# Altium schematic sheet MCU.SchDoc
size Letter; SheetNumber: 2; SheetTotal: 3
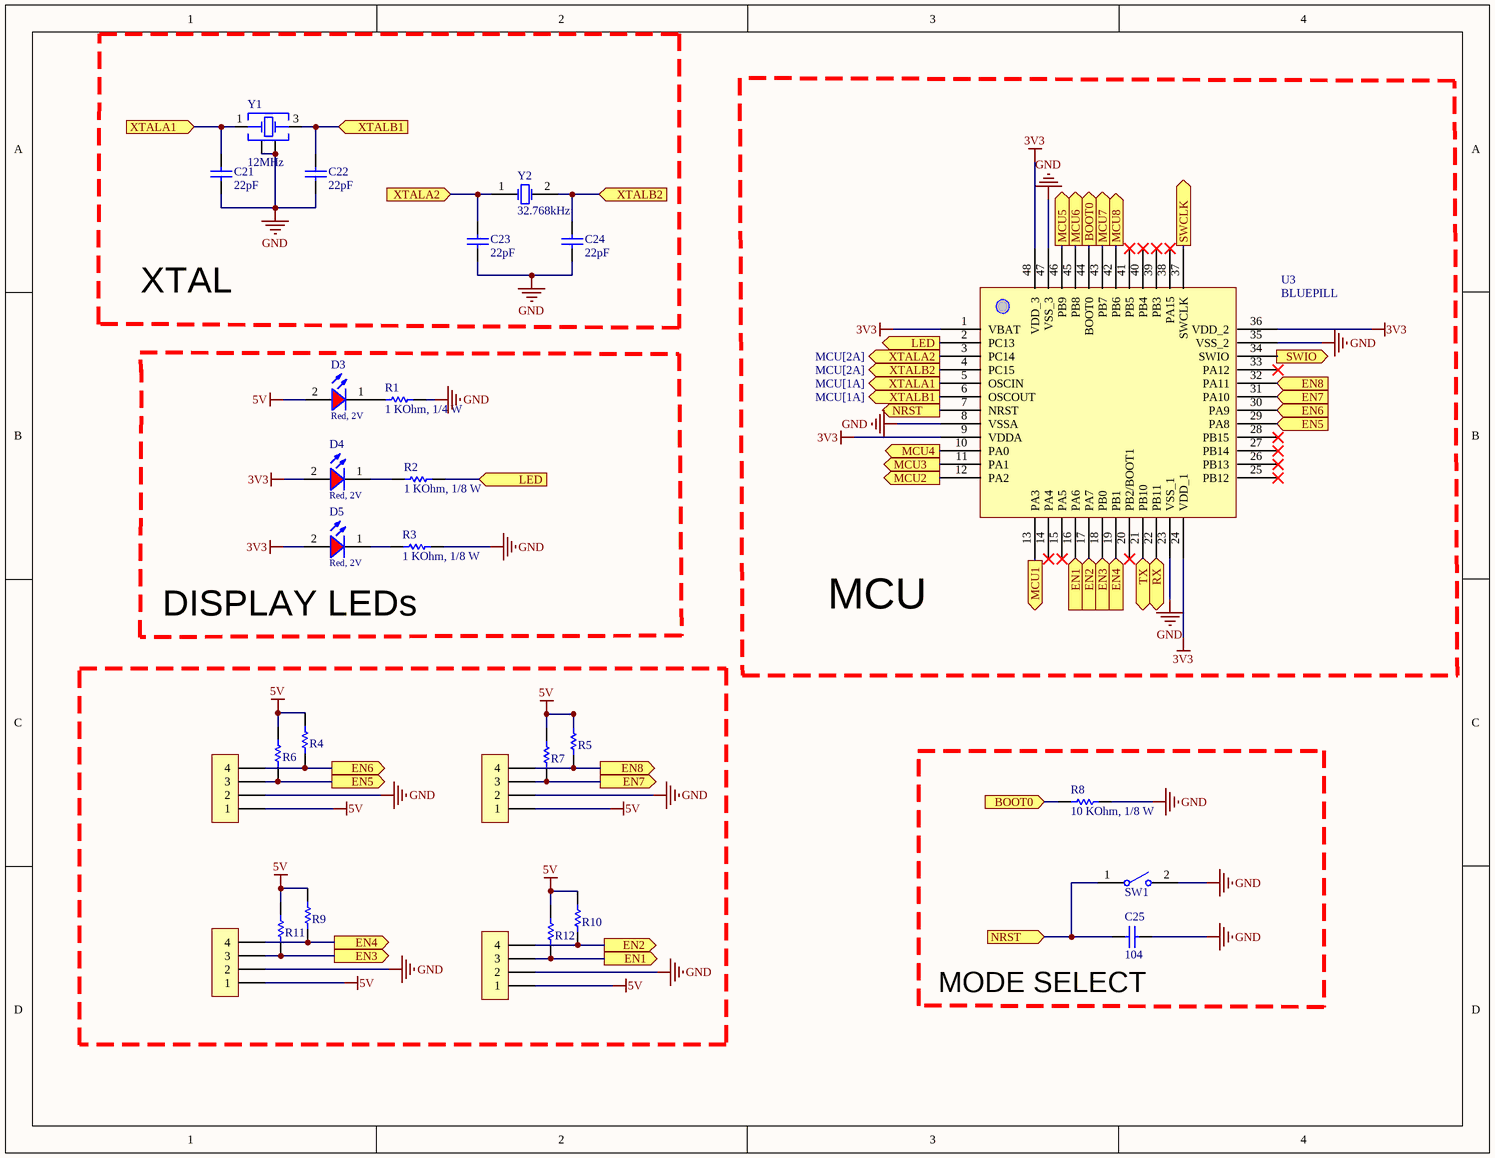
[diagram p0: MCU.SchDoc]

## Parts
C21  22pF  [tu 0603]
C22  22pF  [tu 0603]
C23  22pF  [tu 0603]
C24  22pF  [tu 0603]
C25  104  [tu 0805]
D3  Red, 2V  [WL-SMCW_0603_H=0.7mm]
D4  Red, 2V  [WL-SMCW_0603_H=0.7mm]
D5  Red, 2V  [WL-SMCW_0603_H=0.7mm]
H1  Header 4P 2.54 Duc Cong  [Header 4P DC 2.54]  (value not drawn)
H2  Header 4P 2.54 Duc Cong  [Header 4P DC 2.54]  (value not drawn)
H3  Header 4P 2.54 Duc Cong  [Header 4P DC 2.54]  (value not drawn)
H4  Header 4P 2.54 Duc Cong  [Header 4P DC 2.54]  (value not drawn)
R1  1 KOhm, 1/4 W  [resistor_0603]
R2  1 KOhm, 1/8 W  [RESISTOR_0805]
R3  1 KOhm, 1/8 W  [RESISTOR_0805]
R4  1 KOhm, 1/8 W  [RESISTOR_0805]  (value not drawn)
R5  1 KOhm, 1/8 W  [RESISTOR_0805]  (value not drawn)
R6  1 KOhm, 1/8 W  [RESISTOR_0805]  (value not drawn)
R7  1 KOhm, 1/8 W  [RESISTOR_0805]  (value not drawn)
R8  10 KOhm, 1/8 W  [RESISTOR_0805]
R9  1 KOhm, 1/8 W  [RESISTOR_0805]  (value not drawn)
R10  1 KOhm, 1/8 W  [RESISTOR_0805]  (value not drawn)
R11  1 KOhm, 1/8 W  [RESISTOR_0805]  (value not drawn)
R12  1 KOhm, 1/8 W  [RESISTOR_0805]  (value not drawn)
SW1  434111050826  [WS-TASV_L6W3.5H5_4341x10508x6]  (value not drawn)
U3  BLUEPILL  [STM32F103C8T6]
Y1  12MHz  [WE-XTAL_CFPX-180]
Y2  32.768kHz  [WE-XTAL_WATCH_830014219B]

## Blocks framed on the sheet
XTAL: C21-C24 Y1 Y2
MCU: U3
MODE SELECT: C25 R8 SW1

## Ports
BOOT0 (in, see MCU[3A]), BOOT0 (out, see MCU[3C]), EN1 (in, see MCU[2D]), EN1 (out, see MCU[3C]), EN2 (in, see MCU[2D]), EN2 (out, see MCU[3C]), EN3 (in, see MCU[1D]), EN3 (out, see MCU[3C]), EN4 (in, see MCU[1D]), EN4 (out, see MCU[3C]), EN5 (in, see MCU[1C]), EN5 (out, see MCU[4B]), EN6 (in, see MCU[1C]), EN6 (out, see MCU[4B]), EN7 (in, see MCU[2C]), EN7 (out, see MCU[4B]), EN8 (in, see MCU[2C]), EN8 (out, see MCU[4B]), LED (in, see MCU[3B]), LED (out, see MCU[2B]), MCU1 (out, see BTS7960[2C]), MCU2 (out, see BTS7960[2C]), MCU3 (out, see BTS7960[2C]), MCU4 (out, see BTS7960[2C]), MCU5 (out, see BTS7960[2C]), MCU6 (out, see BTS7960[2C]), MCU7 (out, see BTS7960[2C]), MCU8 (out, see BTS7960[2C]), NRST (in, see MCU[3B]), NRST (out, see MCU[3D]), RX (bidir, see BTS7960[2B]), SWCLK (out, see BTS7960[2B]), SWIO (out, see BTS7960[2A]), TX (bidir, see BTS7960[2B]), XTALA1 (in, see MCU[3B]), XTALA1 (out, see MCU[1A]), XTALA2 (in, see MCU[3B]), XTALA2 (out, see MCU[2A]), XTALB1 (in, see MCU[3B]), XTALB1 (out, see MCU[1A]), XTALB2 (in, see MCU[3B]), XTALB2 (out, see MCU[2A])

## Nets
3V3: D4.2(A) D5.2(A) U3.1(VBAT) U3.9(VDDA) U3.24(VDD_1) U3.36(VDD_2) U3.48(VDD_3)
5V: D3.2(A) H1.1 H2.1 H3.1 H4.1 R4.2 R5.2 R6.2 R7.2 R9.2 R10.2 R11.2 R12.2
GND: C21.1 C22.2 C23.2 C24.2 C25.2 H1.2 H2.2 H3.2 H4.2 R1.2 R3.2 R8.2 SW1.2 U3.8(VSSA) U3.23(VSS_1) U3.35(VSS_2) U3.47(VSS_3) Y1.2(GND) Y1.4(GND)
BOOT0: R8.1 U3.44(BOOT0) ; port BOOT0
EN1: H4.3 R12.1 U3.16(PA6) ; port EN1
EN2: H4.4 R10.1 U3.17(PA7) ; port EN2
EN3: H3.3 R11.1 U3.18(PB0) ; port EN3
EN4: H3.4 R9.1 U3.19(PB1) ; port EN4
EN5: H1.3 R6.1 U3.29(PA8) ; port EN5
EN6: H1.4 R4.1 U3.30(PA9) ; port EN6
EN7: H2.3 R7.1 U3.31(PA10) ; port EN7
EN8: H2.4 R5.1 U3.32(PA11) ; port EN8
LED: R2.2 U3.2(PC13) ; port LED
MCU1: U3.13(PA3) ; port MCU1
MCU2: U3.12(PA2) ; port MCU2
MCU3: U3.11(PA1) ; port MCU3
MCU4: U3.10(PA0) ; port MCU4
MCU5: U3.46(PB9) ; port MCU5
MCU6: U3.45(PB8) ; port MCU6
MCU7: U3.43(PB7) ; port MCU7
MCU8: U3.42(PB6) ; port MCU8
NRST: C25.1 SW1.1 U3.7(NRST) ; port NRST
RX: U3.22(PB11) ; port RX
SWCLK: U3.37(SWCLK) ; port SWCLK
SWIO: U3.34(SWIO) ; port SWIO
TX: U3.21(PB10) ; port TX
XTALA1: C21.2 U3.5(OSCIN) Y1.1(Crystal) ; port XTALA1
XTALA2: C23.1 U3.3(PC14) Y2.1(OSC1) ; port XTALA2
XTALB1: C22.1 U3.6(OSCOUT) Y1.3(Crystal) ; port XTALB1
XTALB2: C24.1 U3.4(PC15) Y2.2(OSC2) ; port XTALB2
NetD3_1: D3.1(K) R1.1
NetD4_1: D4.1(K) R2.1
NetD5_1: D5.1(K) R3.1

Not connected (* = marked no-connect by the designer): U3 14(PA4)* 15(PA5)* 20(PB2/BOOT1)* 25(PB12)* 26(PB13)* 27(PB14)* 28(PB15)* 33(PA12)* 38(PA15)* 39(PB3)* 40(PB4)* 41(PB5)*

## Notes on the sheet
- DISPLAY LEDs

## Library data of the parts
C21-C24 = Tu 0603 22pF 50V 10%: Dán; Don_Vi: Con; So_Chan: 2; Ten_Linh_Kien: Tụ 0603 22pF 50V 10%; Ma_Hang: MH004570; Chung_Loai: Dán; Kieu_Chan: *
C25 = Tu 0805 104 50V 10%: Dán; Don_Vi: Con; So_Chan: 2; Ten_Linh_Kien: Tụ 0805 104-100nF 10% 50V; Ma_Hang: MH004551; Chung_Loai: Dán; Kieu_Chan: *
D3 = 160603RedClear: WL-SMCW SMT Mono-color Chip LED Waterclear, size 0603, Red, 2V, 140deg; Type: Clear; Color: Red; Size: 0603; ComponentLink1Description: Datasheet link; ComponentLink1URL: N/A; ComponentLink2Description: Supplier 1 URL; ComponentLink2URL: https://www.mouser.vn/ProductDetail/Wurth-Elektronik/150060RS75000?qs=LlUlMxKIyB3QnmZ3fw%2FVCA%3D%3D; ComponentLink3Description: Supplier 2 URL; ComponentLink3URL: https://www.digikey.com/en/products/detail/liteon/LTST-C191KRKT/386837; ComponentLink4Description: Supplier 3 URL; ComponentLink4URL: https://www.thegioiic.com/led-do-0603-dan-smd-trong-suot; Supplier 1 Name: Mouser; Supplier 1 SN: 710-150060RS75000; Supplier 1 URL: https://www.mouser.vn/ProductDetail/Wurth-Elektronik/150060RS75000?qs=LlUlMxKIyB3QnmZ3fw%2FVCA%3D%3D; Supplier 2 Name: Digi-Key; Supplier 2 SN: 160-1447-2-ND; Supplier 2 URL: https://www.digikey.com/en/products/detail/liteon/LTST-C191KRKT/386837; Supplier 3 Name: ICDayRoi; Supplier 3 SN: N/A; Supplier 3 URL: https://www.thegioiic.com/led-do-0603-dan-smd-trong-suot; Value: Red, 2V
D4 D5 = 160603RedBlur: WL-SMCW SMT Mono-color Chip LED Blur, size 0603, Red, 2V, 140deg; Color: Red; Size: 0603; Type: Blur; ComponentLink1Description: Datasheet link; ComponentLink1URL: N/A; ComponentLink2Description: Supplier 1 URL; ComponentLink2URL: https://www.mouser.vn/ProductDetail/ROHM-Semiconductor/CSL1901VW1?qs=vvQtp7zwQdNmrXZcE27xEA%3D%3D; ComponentLink3Description: Supplier 2 URL; ComponentLink3URL: https://www.digikey.com/en/products/detail/rohm-semiconductor/SML-D12U8WT86/1641799; ComponentLink4Description: Supplier 3 URL; ComponentLink4URL: N/A; Supplier 1 Name: Mouser; Supplier 1 SN: 755-CSL1901VW1; Supplier 1 URL: https://www.mouser.vn/ProductDetail/ROHM-Semiconductor/CSL1901VW1?qs=vvQtp7zwQdNmrXZcE27xEA%3D%3D; Supplier 2 Name: Digi-Key; Supplier 2 SN: 511-1580-2-ND; Supplier 2 URL: https://www.digikey.com/en/products/detail/rohm-semiconductor/SML-D12U8WT86/1641799; Supplier 3 Name: ICDayRoi; Supplier 3 SN: N/A; Supplier 3 URL: N/A; Value: Red, 2V
H1-H4 = Header 4P 2.54 Duc Cong: Cắm; Ten_Linh_Kien: Header 4P XH2.54-4P Đực Cong; Don_Vi: Con; Ma_Hang: MH001310; Chung_Loai: Cắm
R1 = 0006031021: RES, size 0603, 1 KOhm, 1/4 W; Manufacture  Name: OEM; Resistance: 1 KOhm; Rated Power: 1/4 W; Resistance Tolerance: +/-1%; Size: 0603; Mounting Technology: SMT; Supplier 1 Name: Mouser; Supplier 1 SN: 71-RCS06031K00FKEA; Supplier 2 Name: Digi-Key; Supplier 2 SN: YAG5829TR-ND YAG5829CT-ND YAG5829DKR-ND; Supplier 1 URL: https://www.mouser.vn/ProductDetail/Vishay-Dale/RCS06031K00FKEA?qs=sGAEpiMZZMvdGkrng054t9clqp6gtJJdzI9PGMrTQi4RTIuHToNahw%3D%3D; Supplier 3 Name: thegioiic; Supplier 3 SN: N/A; Supplier 3 URL: N/A; Manufacture  SN: OEM; Value: 1 KOhm, 1/4 W; ComponentLink1Description: Datasheet link; ComponentLink1URL: https://www.yageo.com/upload/media/product/productsearch/datasheet/rchip/PYu-SR_20105_RoHS_L_10.pdf; ComponentLink2Description: Supplier 1 URL; ComponentLink2URL: N/A; ComponentLink3Description: Supplier 2 URL; ComponentLink3URL: https://www.digikey.com/en/products/detail/yageo/SR0603FR-7T1KL/9373103; ComponentLink4Description: Supplier 3 URL; ComponentLink4URL: N/A; Supplier 2 URL: https://www.digikey.com/en/products/detail/yageo/SR0603FR-7T1KL/9373103
R2-R7 R9-R12 = 0008051025: RES, size 0805, 1 KOhm, 1/8 W; Manufacture  Name: Vishay Dale; Manufacture  SN: CRCW08051K00JNEAC; Resistance tolerance: +/-5%; Rated Power: 1/8 W; Resistance: 1 KOhm; Size: 0805; Mounting Technology: SMT; Supplier 1 Name: Mouser; Supplier 1 SN: 71-CRCW08051K00JNEC; Supplier 1 URL: https://www.mouser.vn/ProductDetail/Vishay-Dale/CRCW08051K00JNEC?qs=OW6ROCK%252BaiZqKFsNe9zjFw%3D%3D; Supplier 2 Name: Digi-Key; Supplier 2 SN: 541-4162-2-ND; Supplier 2 URL: https://www.digikey.com/en/products/detail/vishay-dale/CRCW08051K00JNEAC/7928584; Supplier 3 Name: Thegioiic; Supplier 3 SN: N/A; Supplier 3 URL: https://www.thegioiic.com/dien-tro-1-kohm-0805-5-; Value: 1 KOhm, 1/8 W; ComponentLink1Description: Datasheet link; ComponentLink1URL: https://www.vishay.com/docs/28773/crcwce3.pdf; ComponentLink2Description: Supplier 1 URL; ComponentLink2URL: https://www.mouser.vn/ProductDetail/Vishay-Dale/CRCW08051K00JNEC?qs=OW6ROCK%252BaiZqKFsNe9zjFw%3D%3D; ComponentLink3Description: Supplier 2 URL; ComponentLink3URL: https://www.digikey.com/en/products/detail/vishay-dale/CRCW08051K00JNEAC/7928584; ComponentLink4Description: Supplier 3 URL; ComponentLink4URL: https://www.thegioiic.com/dien-tro-1-kohm-0805-5-
R8 = 0008051035: RES, size 0805, 10 KOhm, 1/8 W; Manufacture  Name: Vishay Dale; Manufacture  SN: CRCW080510K0JNEAC; Resistance tolerance: +/-5%; Rated Power: 1/8 W; Resistance: 10 KOhm; Size: 0805; Mounting Technology: SMT; Supplier 1 Name: Mouser; Supplier 1 SN: 71-CRCW080510K0JNEB; Supplier 1 URL: https://www.mouser.vn/ProductDetail/Vishay-Dale/CRCW080510K0JNEB?qs=LOX6nxTstiZ5fn9YUdHx5A%3D%3D; Supplier 2 Name: Digi-Key; Supplier 2 SN: 541-4163-2-ND; Supplier 2 URL: https://www.digikey.com/en/products/detail/vishay-dale/CRCW080510K0JNEAC/7928585; Supplier 3 Name: Thegioiic; Supplier 3 SN: N/A; Supplier 3 URL: N/A; Value: 10 KOhm, 1/8 W; ComponentLink1Description: Datasheet link; ComponentLink1URL: https://www.vishay.com/docs/28773/crcwce3.pdf; ComponentLink2Description: Supplier 1 URL; ComponentLink2URL: https://www.mouser.vn/ProductDetail/Vishay-Dale/CRCW080510K0JNEB?qs=LOX6nxTstiZ5fn9YUdHx5A%3D%3D; ComponentLink3Description: Supplier 2 URL; ComponentLink3URL: https://www.digikey.com/en/products/detail/vishay-dale/CRCW080510K0JNEAC/7928585; ComponentLink4Description: Supplier 3 URL; ComponentLink4URL: N/A
SW1 = 434111050826: WS-TASV SMT Tact Switch, L6 x W3.5 x H5mm, 260g, SPST-NO, 12V, 50mA; Manufacturer: Wurth Elektronik; Washable: No; Rated Voltage: 12VDC; Manufacturer Part Number: 434111050826; Category: Tact Switches; Match Code: WS-TASV; ComponentLink2Description: Datasheet Link; ComponentLink2URL: https://www.we-online.com/redexpert/spec/434111050826?ad; Mount: Surface Mount; Operating Temperature Max: 85°C; Operating Temperature Min: -40°C; Packaging: Tape and Reel; Length: 6mm; Width: 3.5mm; Height: 5mm; Circuit: SPST-NO; Contact Material: Stainless Steel; Operation Force: 260g; Rated Current: 50mA; Terminal Material: Copper Alloy; Terminal Plating: Silver; Supplier 1 Name: Mouser; Supplier 1 SN: 710-434111050826; Supplier 1 URL: https://www.mouser.vn/ProductDetail/Wurth-Elektronik/434111050826?qs=wr8lucFkNMW%252BYjUPWhhK5A%3D%3D; Supplier 2 Name: Digi-Key; Supplier 2 SN: 732-7041-2-ND; Supplier 2 URL: https://www.digikey.com/en/products/detail/w%C3%BCrth-elektronik/434111050826/5209074; Supplier 3 Name: Thegioiic; Supplier 3 SN: N/A; Supplier 3 URL: https://www.thegioiic.com/nut-nhan-3-5x6mm-cao-5mm-2-chan-smd-dau-trang
U3 = STM32F103C8T6
Y1 = 073525126010: WE-XTAL Quartz Crystal, SMT, CFPX-180, 12MHz, +/-30ppm; Manufacturer Part Number: NX3225SA-12MHZ-STD-CSR-6; Manufacturer: NDK; Frequency Stability: +/-25ppm; Load Capacitance: 8pF; Frequency Tolerance: +/-15ppm; Frequency: 12MHz; Mounting Technology: SMT; Supplier 3 URL: https://www.thegioiic.com/thach-anh-12mhz-5032-4-chan-smd; ComponentLink1Description: Datasheet; ComponentLink1URL: https://www.mouser.com/datasheet/2/905/c_NX3225SA_e-1317523.pdf; Supplier 1 URL: https://www.mouser.com/ProductDetail/NDK/NX3225SA-12MHZ-STD-CSR-6?qs=55YtniHzbhCh3aOy4zgUJQ%3D%3D; Supplier 2 URL: https://www.digikey.com/en/products/detail/ndk-america-inc/NX3225SA-12MHZ-STD-CSR-6/3125639; Value: 12MHz; Operating Temperature Max: + 70 C; Operating Temperature Min: + 20 C; Package / Case: CFPX-104/5032; Packaging: Tape and Reel; Supplier 1: Mouser; Supplier 1 Part Number: 344-NX3225SA12MCSR6; Supplier 2: Digi-Key; Supplier 2 Part Number: 644-1180-2-ND; Supplier 3: thegioiic; Supplier 3 Part Number: N/A; LCSC Part #: N/A
Y2 = 070002323006: WE-XTAL Watch Crystal, THT, WATCH, 32.768kHz, +/-20ppm; Manufacturer Part Number: 830014219B; Manufacturer: Wurth Elektronik; Load Capacitance: 6pF; Frequency Stability: -; Frequency: 32.768kHz; Frequency Tolerance: +/-20ppm; Supplier 3 URL: https://www.thegioiic.com/thach-anh-32-768khz-2x6mm; ComponentLink1Description: Datasheet; ComponentLink1URL: https://katalog.we-online.com/pbs/datasheet/830014219B.pdf; Supplier 1 URL: https://www.mouser.com/ProductDetail/Wurth-Elektronik/830014219B?qs=2WXlatMagcHtIp%252BQ4AMyQg%3D%3D; Supplier 2 URL: https://www.digikey.com/en/products/detail/w%C3%BCrth-elektronik/830014219b/13900227; Value: 32.768kHz; Mount: THT; Operating Temperature Max: + 85 C; Operating Temperature Min: - 40 C; Package / Case: WATCH; Packaging: Tape and Reel; Supplier 1: Mouser; Supplier 1 Part Number: 710-830014219B; Supplier 2: Digi-Key; Supplier 2 Part Number: 1923-830014219B-ND; Supplier 3: thegioiic; Supplier 3 Part Number: N/A; LCSC Part #: N/A